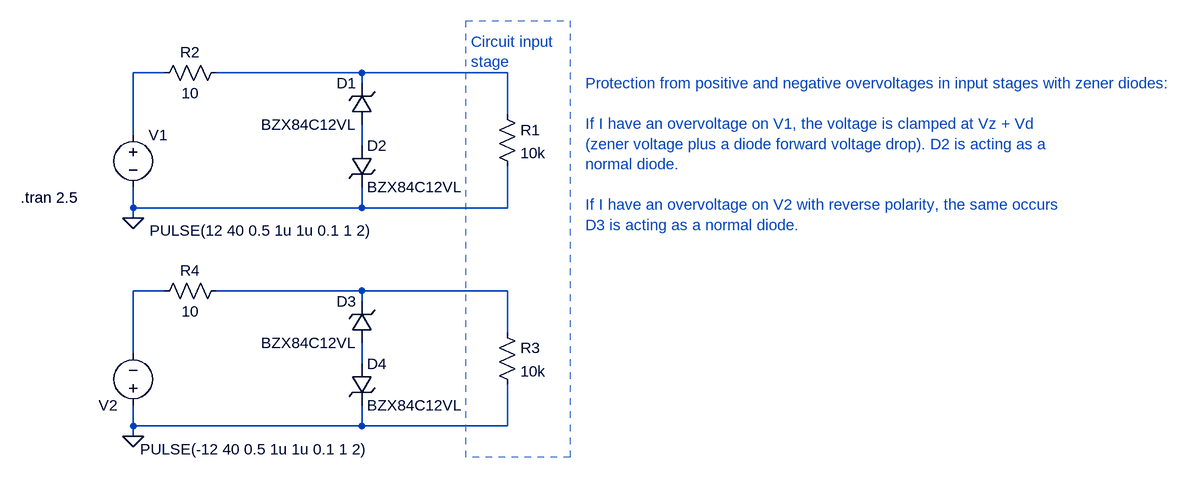
[diagram p0: schematic overvoltage-protection-zener-diodes.asc]
overvoltage-protection-zener-diodes.asc, the LTspice schematic file:
Version 4
SHEET 1 1648 680
WIRE 32 32 -16 32
WIRE 336 32 112 32
WIRE 560 32 336 32
WIRE 336 48 336 32
WIRE 560 96 560 32
WIRE -16 128 -16 32
WIRE 336 144 336 112
WIRE -16 240 -16 208
WIRE 336 240 336 208
WIRE 336 240 -16 240
WIRE 560 240 560 176
WIRE 560 240 336 240
WIRE -16 256 -16 240
WIRE 32 368 -16 368
WIRE 336 368 112 368
WIRE 560 368 336 368
WIRE 336 384 336 368
WIRE 560 432 560 368
WIRE -16 464 -16 368
WIRE 336 480 336 448
WIRE -16 576 -16 544
WIRE 336 576 336 544
WIRE 336 576 -16 576
WIRE 560 576 560 512
WIRE 560 576 336 576
WIRE -16 592 -16 576
FLAG -16 256 0
FLAG -16 592 0
SYMBOL voltage -16 112 R0
WINDOW 3 25 163 Left 2
WINDOW 123 0 0 Left 0
WINDOW 39 0 0 Left 0
SYMATTR InstName V1
SYMATTR Value PULSE(12 40 0.5 1u 1u 0.1 1 2)
SYMBOL zener 352 112 R180
WINDOW 0 24 64 Left 2
WINDOW 3 24 0 Left 2
SYMATTR InstName D1
SYMATTR Value BZX84C12VL
SYMATTR Description Diode
SYMATTR Type diode
SYMBOL res 544 80 R0
SYMATTR InstName R1
SYMATTR Value 10k
SYMBOL zener 320 144 R0
SYMATTR InstName D2
SYMATTR Value BZX84C12VL
SYMATTR Description Diode
SYMATTR Type diode
SYMBOL res 16 48 R270
WINDOW 0 32 56 VTop 2
WINDOW 3 0 56 VBottom 2
SYMATTR InstName R2
SYMATTR Value 10
SYMBOL voltage -16 560 R180
WINDOW 3 -363 -52 Left 2
WINDOW 123 0 0 Left 0
WINDOW 39 0 0 Left 0
SYMATTR InstName V2
SYMATTR Value PULSE(-12 40 0.5 1u 1u 0.1 1 2)
SYMBOL zener 352 448 R180
WINDOW 0 24 64 Left 2
WINDOW 3 24 0 Left 2
SYMATTR InstName D3
SYMATTR Value BZX84C12VL
SYMATTR Description Diode
SYMATTR Type diode
SYMBOL res 544 416 R0
SYMATTR InstName R3
SYMATTR Value 10k
SYMBOL zener 320 480 R0
SYMATTR InstName D4
SYMATTR Value BZX84C12VL
SYMATTR Description Diode
SYMATTR Type diode
SYMBOL res 16 384 R270
WINDOW 0 32 56 VTop 2
WINDOW 3 0 56 VBottom 2
SYMATTR InstName R4
SYMATTR Value 10
TEXT -189 224 Left 2 !.tran 2.5
TEXT 680 48 Left 2 ;Protection from positive and negative overvoltages in input stages with zener diodes:\n \nIf I have an overvoltage on V1, the voltage is clamped at Vz + Vd\n(zener voltage plus a diode forward voltage drop). D2 is acting as a \nnormal diode.\n \nIf I have an overvoltage on V2 with reverse polarity, the same occurs\nD3 is acting as a normal diode.
TEXT 504 -16 Left 2 ;Circuit input\nstage
RECTANGLE Normal 656 624 496 -48 2

The netlist it stands for:
* overvoltage-protection-zener-diodes.asc
V1 N001 0 PULSE(12 40 0.5 1u 1u 0.1 1 2)
D1 N003 N002 BZX84C12VL
R1 N002 0 10k
D2 N003 0 BZX84C12VL
R2 N001 N002 10
V2 0 N004 PULSE(-12 40 0.5 1u 1u 0.1 1 2)
D3 N006 N005 BZX84C12VL
R3 N005 0 10k
D4 N006 0 BZX84C12VL
R4 N004 N005 10
.model D D
.lib standard.dio
.tran 2.5
* Protection from positive and negative overvoltages in input stages with zener diodes:
* If I have an overvoltage on V1, the voltage is clamped at Vz + Vd
* (zener voltage plus a diode forward voltage drop). D2 is acting as a
* normal diode.
* If I have an overvoltage on V2 with reverse polarity, the same occurs
* D3 is acting as a normal diode.
* Circuit input
* stage
.backanno
.end